# EAGLE design hothouse-no-branding (EAGLE 9.6.2)
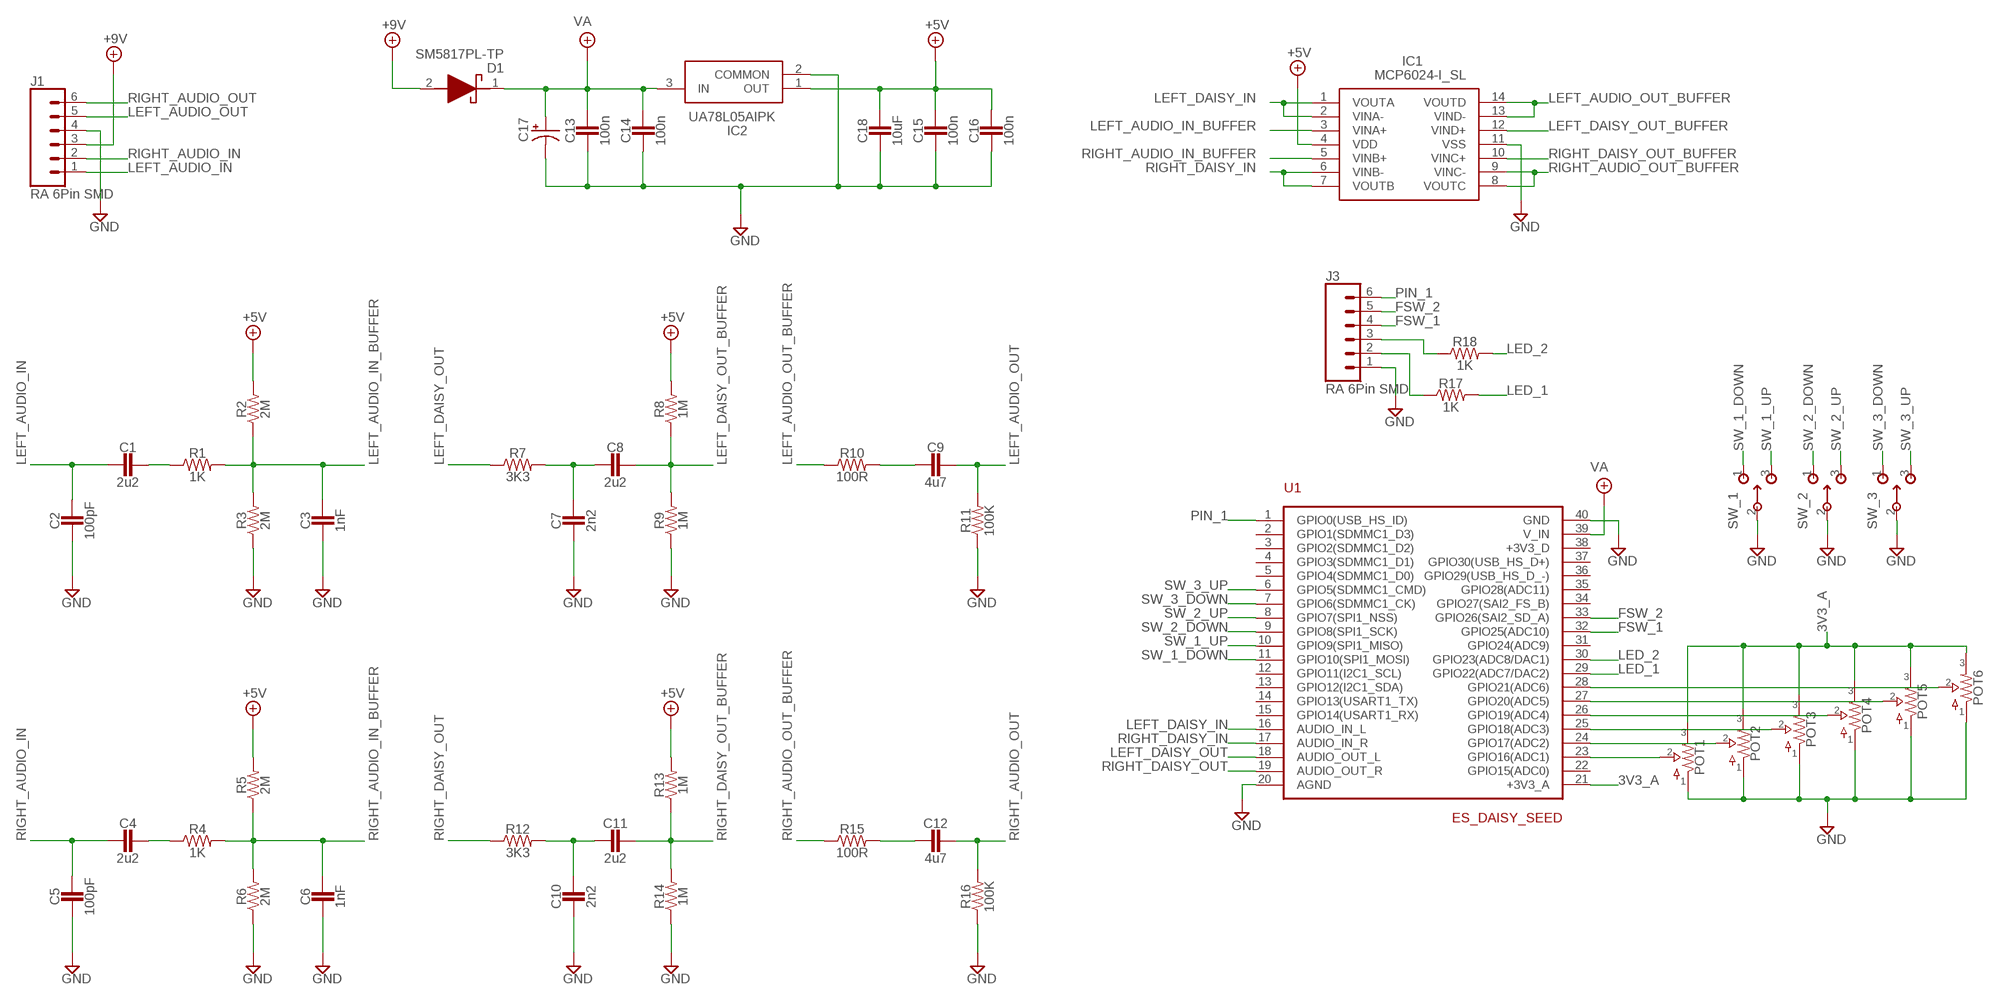
[diagram p0: schematic, sheet 1]

## Parts
C1  2u2  CAP1206  [RESISTOR_C1206]
C2  100pF  CAP0603  [RESISTOR_R0603]
C3  1nF  CAP0603  [RESISTOR_R0603]
C4  2u2  CAP1206  [RESISTOR_C1206]
C5  100pF  CAP0603  [RESISTOR_R0603]
C6  1nF  CAP0603  [RESISTOR_R0603]
C7  2n2  CAP0603  [RESISTOR_R0603]
C8  2u2  CAP1206  [RESISTOR_C1206]
C9  4u7  CAP1206  [RESISTOR_C1206]
C10  2n2  CAP0603  [RESISTOR_R0603]
C11  2u2  CAP1206  [RESISTOR_C1206]
C12  4u7  CAP1206  [RESISTOR_C1206]
C13  100n  CAP0805  [RESISTOR_C0805]
C14  100n  CAP0805  [RESISTOR_C0805]
C15  100n  CAP0805  [RESISTOR_C0805]
C16  100n  CAP0805  [RESISTOR_C0805]
C17  0631  [063_025]
C18  10uF  CAP0805  [RESISTOR_C0805]
D1  SM5817PL-TP  [SOD3716X120N]
IC1  MCP6024-I_SL  [SOIC127P600X175-14N]
IC2  UA78L05AIPK  [PK(R-PSSO-F3)]
J1  RA 6Pin SMD  CONN_06SILK_FEMALE_PTH  [1X06]
J3  RA 6Pin SMD  CONN_06SILK_FEMALE_PTH  [1X06]
POT1  16MM.1  [16MM_B.MOUNT]
POT2  16MM.1  [16MM_B.MOUNT]
POT3  16MM.1  [16MM_B.MOUNT]
POT4  16MM.1  [16MM_B.MOUNT]
POT5  16MM.1  [16MM_B.MOUNT]
POT6  16MM.1  [16MM_B.MOUNT]
R1  1K  RESISTOR0603  [RESISTOR_R0603]
R2  2M  RESISTOR0603  [RESISTOR_R0603]
R3  2M  RESISTOR0603  [RESISTOR_R0603]
R4  1K  RESISTOR0603  [RESISTOR_R0603]
R5  2M  RESISTOR0603  [RESISTOR_R0603]
R6  2M  RESISTOR0603  [RESISTOR_R0603]
R7  3K3  RESISTOR0603  [RESISTOR_R0603]
R8  1M  RESISTOR0603  [RESISTOR_R0603]
R9  1M  RESISTOR0603  [RESISTOR_R0603]
R10  100R  RESISTOR0603  [RESISTOR_R0603]
R11  100K  RESISTOR0603  [RESISTOR_R0603]
R12  3K3  RESISTOR0603  [RESISTOR_R0603]
R13  1M  RESISTOR0603  [RESISTOR_R0603]
R14  1M  RESISTOR0603  [RESISTOR_R0603]
R15  100R  RESISTOR0603  [RESISTOR_R0603]
R16  100K  RESISTOR0603  [RESISTOR_R0603]
R17  1K  RESISTOR0603  [RESISTOR_R0603]
R18  1K  RESISTOR0603  [RESISTOR_R0603]
SW_1  SPDT.LUGS  [SPDT.LUGS]
SW_2  SPDT.LUGS  [SPDT.LUGS]
SW_3  SPDT.LUGS  [SPDT.LUGS]
U1  ES_DAISY_SEED  [ES_DAISY_SEED]

## Nets
3V3_A: POT1.3 POT2.3 POT3.3 POT4.3 POT5.3 POT6.3 U1.21(+3V3_A)
+5V: C15.1 C16.1 C18.1 IC1.4(VDD) IC2.1(OUT) R2.2 R5.2 R8.2 R13.2
+9V: D1.2(A) J1.3
FSW_1: J3.4 U1.32(GPIO25(ADC10))
FSW_2: J3.5 U1.33(GPIO26(SAI2_SD_A))
GND: C2.2 C3.2 C5.2 C6.2 C7.2 C10.2 C13.2 C14.2 C15.2 C16.2 C17.- C18.2 IC1.11(VSS) IC2.2(COMMON) J1.4 J3.1 POT1.1 POT2.1 POT3.1 POT4.1 POT5.1 POT6.1 R3.1 R6.1 R9.1 R11.1 R14.1 R16.1 SW_1.2 SW_2.2 SW_3.2 U1.20(AGND) U1.40(GND)
LED_1: R17.2 U1.29(GPIO22(ADC7/DAC2))
LED_2: R18.2 U1.30(GPIO23(ADC8/DAC1))
LEFT_AUDIO_IN: C1.2 C2.1 J1.1
LEFT_AUDIO_IN_BUFFER: C3.1 IC1.3(VINA+) R1.2 R2.1 R3.2
LEFT_AUDIO_OUT: C9.1 J1.5 R11.2
LEFT_AUDIO_OUT_BUFFER: IC1.13(VIND-) IC1.14(VOUTD) R10.1
LEFT_DAISY_IN: IC1.1(VOUTA) IC1.2(VINA-) U1.16(AUDIO_IN_L)
LEFT_DAISY_OUT: R7.1 U1.18(AUDIO_OUT_L)
LEFT_DAISY_OUT_BUFFER: C8.1 IC1.12(VIND+) R8.1 R9.2
N$1: C4.1 R4.1
N$2: C1.1 R1.1
N$3: POT1.2 U1.23(GPIO16(ADC1))
N$4: C10.1 C11.2 R12.2
N$5: C12.2 R15.2
N$6: POT2.2 U1.24(GPIO17(ADC2))
N$7: C7.1 C8.2 R7.2
N$8: POT3.2 U1.25(GPIO18(ADC3))
N$9: POT4.2 U1.26(GPIO19(ADC4))
N$10: POT5.2 U1.27(GPIO20(ADC5))
N$11: POT6.2 U1.28(GPIO21(ADC6))
N$12: J3.3 R18.1
N$13: C9.2 R10.2
N$14: J3.2 R17.1
PIN_1: J3.6 U1.1(GPIO0(USB_HS_ID))
RIGHT_AUDIO_IN: C4.2 C5.1 J1.2
RIGHT_AUDIO_IN_BUFFER: C6.1 IC1.5(VINB+) R4.2 R5.1 R6.2
RIGHT_AUDIO_OUT: C12.1 J1.6 R16.2
RIGHT_AUDIO_OUT_BUFFER: IC1.8(VOUTC) IC1.9(VINC-) R15.1
RIGHT_DAISY_IN: IC1.6(VINB-) IC1.7(VOUTB) U1.17(AUDIO_IN_R)
RIGHT_DAISY_OUT: R12.1 U1.19(AUDIO_OUT_R)
RIGHT_DAISY_OUT_BUFFER: C11.1 IC1.10(VINC+) R13.1 R14.2
SW_1_DOWN: SW_1.1 U1.11(GPIO10(SPI1_MOSI))
SW_1_UP: SW_1.3 U1.10(GPIO9(SPI1_MISO))
SW_2_DOWN: SW_2.1 U1.9(GPIO8(SPI1_SCK))
SW_2_UP: SW_2.3 U1.8(GPIO7(SPI1_NSS))
SW_3_DOWN: SW_3.1 U1.7(GPIO6(SDMMC1_CK))
SW_3_UP: SW_3.3 U1.6(GPIO5(SDMMC1_CMD))
VA: C13.1 C14.1 C17.+ D1.1(K) IC2.3(IN) U1.39(V_IN)
Unconnected: U1.2(GPIO1(SDMMC1_D3)) U1.3(GPIO2(SDMMC1_D2)) U1.4(GPIO3(SDMMC1_D1)) U1.5(GPIO4(SDMMC1_D0)) U1.12(GPIO11(I2C1_SCL)) U1.13(GPIO12(I2C1_SDA)) U1.14(GPIO13(USART1_TX)) U1.15(GPIO14(USART1_RX)) U1.22(GPIO15(ADC0)) U1.31(GPIO24(ADC9)) U1.34(GPIO27(SAI2_FS_B)) U1.35(GPIO28(ADC11)) U1.36(GPIO29(USB_HS_D_-)) U1.37(GPIO30(USB_HS_D+)) U1.38(+3V3_D)

## Library data of the parts
C1-C16 C18 = hothouse-no-branding:CAP
C17 = hothouse-no-branding:063: 33 - 220uF Xicon values at Mouser.com 10V: 220uF; 16V: 100uF; 25V: 100uF; 50V: 33uF
D1 = hothouse-no-branding:SM5817PL-TP: Schottky Barrier Rectifiers Source: Datasheet <https://mccsemi.com/pdf/Products/SM5817PL-SM5819PL(SOD-123FL).pdf>; DESCRIPTION: Schottky Barrier Rectifiers; HEIGHT: 1.2mm; MANUFACTURER_NAME: MCC; MANUFACTURER_PART_NUMBER: SM5817PL-TP; MOUSER_PART_NUMBER: 833-SM5817PL-TP; MOUSER_PRICE-STOCK: https://www.mouser.co.uk/ProductDetail/Micro-Commercial-Components-MCC/SM5817PL-TP?qs=SdqRYZZ9IxAlhPsFLNd53A%3D%3D
IC1 = hothouse-no-branding:MCP6024-I_SL: Quad 2.3V 10MHz Op Amp,MCP6024-I/SL Source: Datasheet <https://datasheet.datasheetarchive.com/originals/distributors/SFDatasheet-4/sf-00090088.pdf>; DESCRIPTION: Quad 2.3V 10MHz Op Amp,MCP6024-I/SL; HEIGHT: 1.75mm; MANUFACTURER_NAME: Microchip; MANUFACTURER_PART_NUMBER: MCP6024-I/SL; MOUSER_PART_NUMBER: 579-MCP6024-I/SL; MOUSER_PRICE-STOCK: https://www.mouser.co.uk/ProductDetail/Microchip-Technology/MCP6024-I-SL?qs=QQ%252Byn%2FmNCzxlSLtX4H41uA%3D%3D
IC2 = hothouse-no-branding:UA78L05AIPK: 100-mA, 30-V VIN, Positive-Voltage Linear Regulators Source: Datasheet <http://www.ti.com/lit/ds/symlink/ua78l.pdf>; DESCRIPTION: 100-mA, 30-V VIN, Positive-Voltage Linear Regulators; HEIGHT: mm; MANUFACTURER_NAME: Texas Instruments; MANUFACTURER_PART_NUMBER: UA78L05AIPK; MOUSER_PART_NUMBER: 595-UA78L05AIPK; MOUSER_PRICE-STOCK: https://www.mouser.co.uk/ProductDetail/Texas-Instruments/UA78L05AIPK?qs=0O%2FZFlpUpJWsJcopcQmf%252BQ%3D%3D
J1 J3 = hothouse-no-branding:CONN_06: Multi connection point. Often used as Generic Header-pin footprint for 0.1 inch spaced/style header connections On any of the 0.1 inch spaced packages, you can populate with these: Break Away Headers - Straight <https://www.sparkfun.com/products/116> (PRT-00116) Break Away Male Headers - Right Angle <https://www.sparkfun.com/products/553> (PRT-00553) Female Headers <https://www.sparkfun.com/products/115> (PRT-00115) Break Away Headers - Machine Pin <https://www.sparkfun.com/products/117> (PRT-00117) Break Away Female Headers - Swiss Machine Pin <https://www.sparkfun.com/products/743> (PRT-00743) Arduino Stackable Header - 6 Pin <https://www.sparkfun.com/products/9280> (PRT-09280) For SCREWTERMINALS and SPRING TERMINALS visit here: Screw Terimnals on SparkFun.com <https://www.sparkfun.com/search/results?term=Screw+Terminals> (5mm/3.5mm/2.54mm spacing) This device is also useful as a general connection point to wire up your design to another part of your project. Our various solder wires solder well into these plated through hole pads. Hook-Up Wire - Assortment (Stranded, 22 AWG) <https://www.sparkfun.com/products/11375> (PRT-11375) Hook-Up Wire - Assortment (Solid Core, 22 AWG) <https://www.sparkfun.com/products/11367> (PRT-11367) View the entire wire category on our website here <https://www.sparkfun.com/categories/141>; PROD_ID: CONN-11293; SF_ID: GPS-00579
POT1-POT6 = hothouse-no-branding:16MM: 16mm Poteniometers
R1-R18 = hothouse-no-branding:RESISTOR
SW_1-SW_3 = hothouse-no-branding:SPDT: SPDT Switches
U1 = hothouse-no-branding:ES_DAISY_SEED; IPN: Daisy Seed

## Board
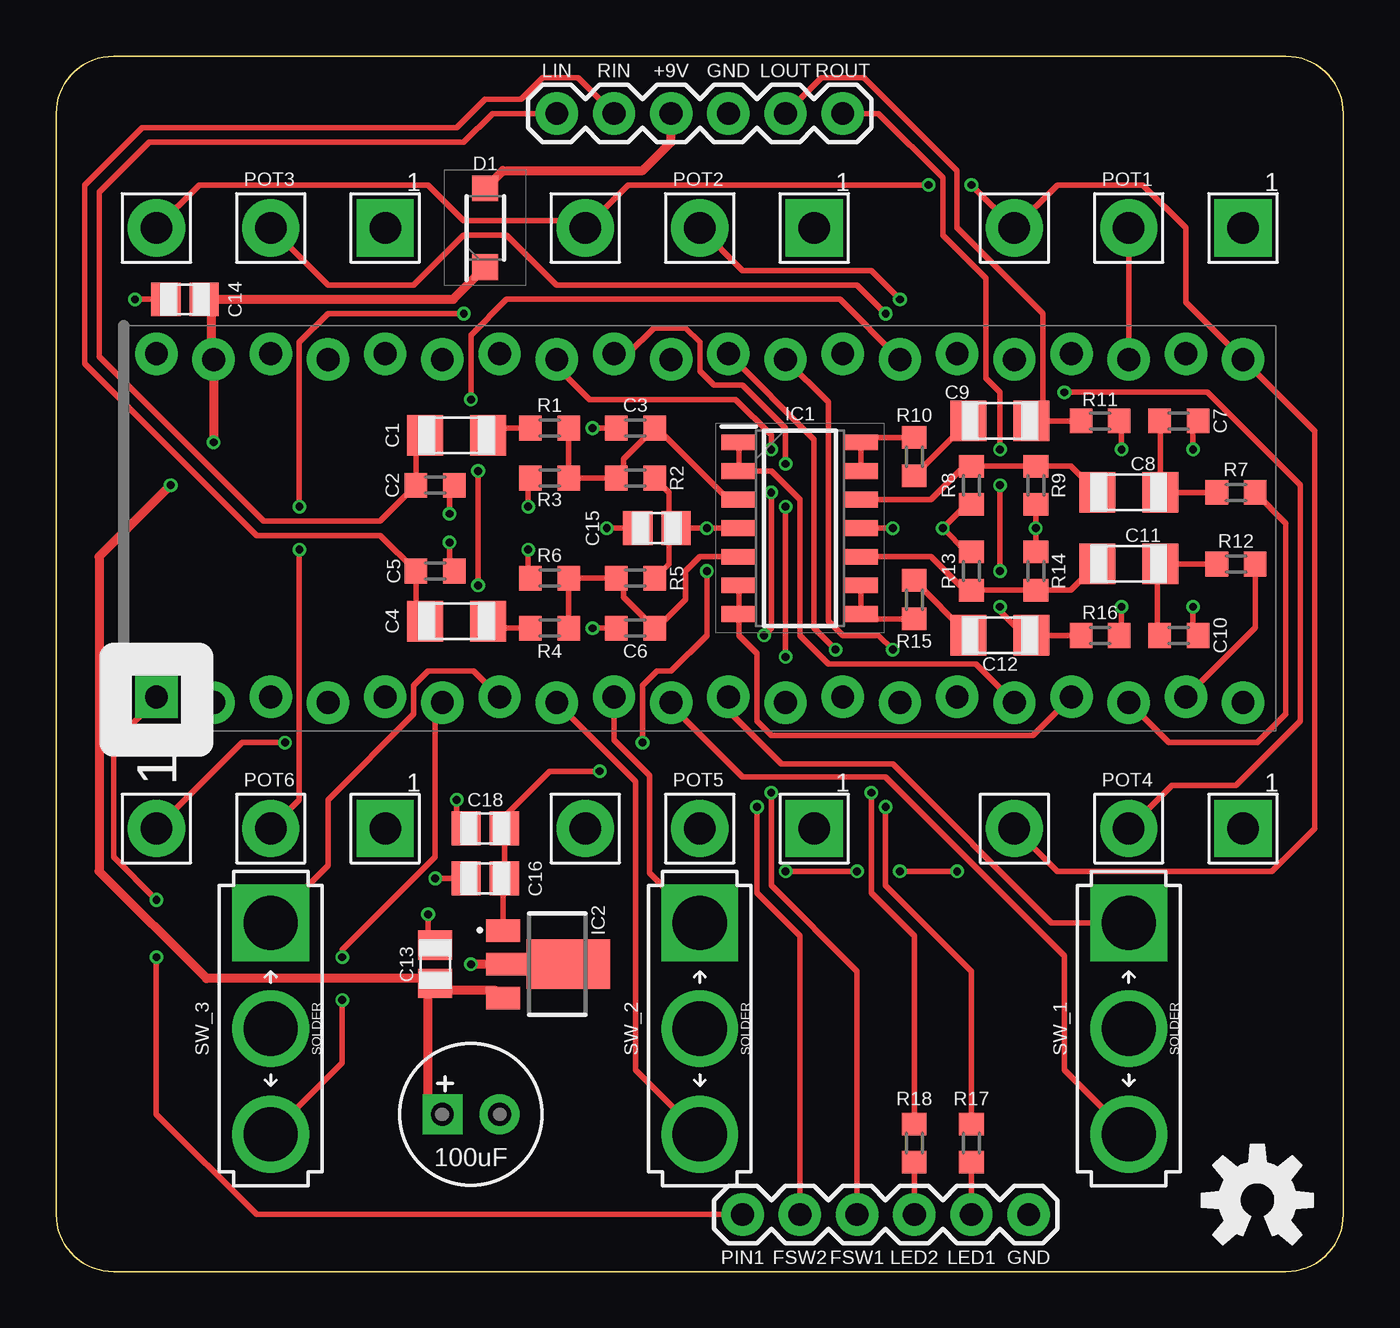
[diagram p1: board, top side]
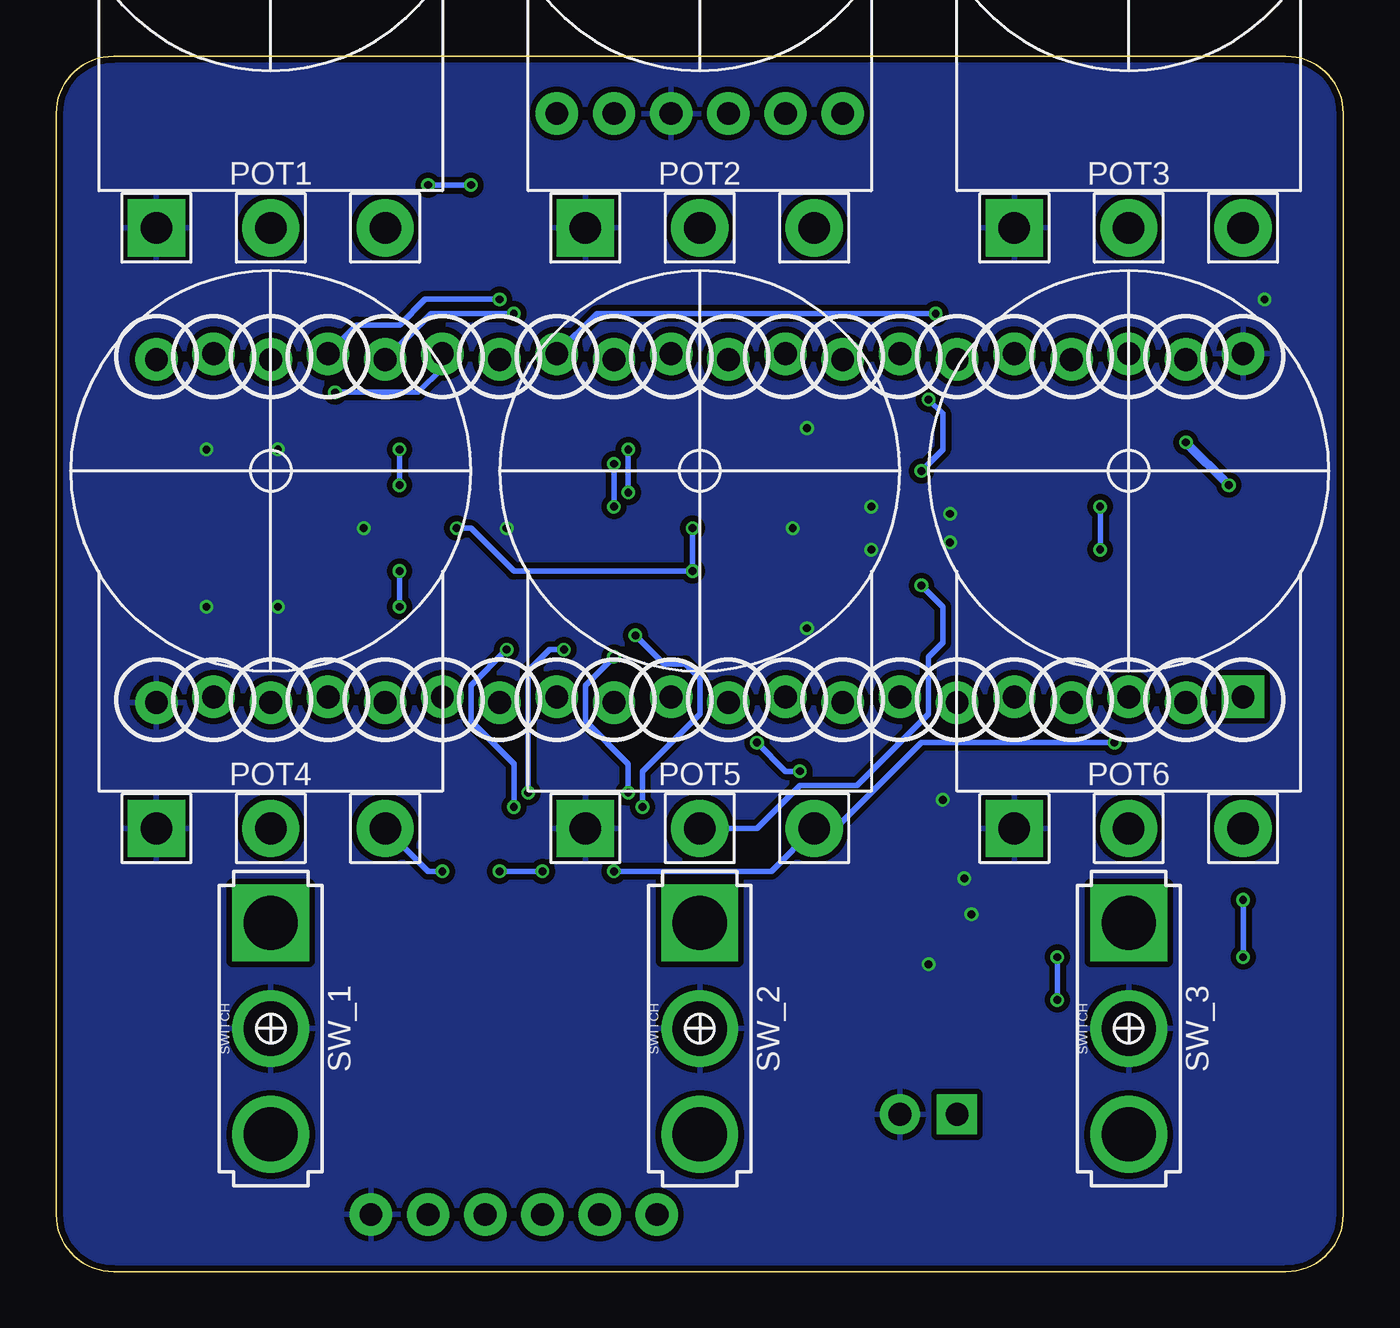
[diagram p2: board, bottom side, seen from below]

Size 57.15 x 53.98 mm. Coordinates in mm from the lower left corner, seen from the top.
Outline: 0,2.54 0,51.44 arc-90 2.54,53.98 54.61,53.98 arc-90 57.15,51.44 57.15,2.54 arc-90 54.61,0 2.54,0 arc-90 0,2.54
Copper layers (1*16): Top 0.035mm / dielectric 1.5mm / Bottom 0.035mm
Design rules "SparkFun-2-Layer-Minimum-JLCPCB": minimum track width 5mil, minimum drill 0.3mm, track to track 5mil, track to pad 5mil, pad to pad 5mil, via to via 5mil, smd to smd 5mil, copper to edge 7mil, drill to drill 7mil, minimum pad ring 5mil, minimum via ring 5mil, stop-mask expansion 2.5mil, vias tented up to drill 25mil, thermal gap 10mil

### Footprints (pad centres in the part's own frame; a part is rotated, then mirrored left to right if it is on the bottom)
RESISTOR_C1206 = smd 1.6 x 1.8: 1 -1.4,0; 2 1.4,0
RESISTOR_R0603 = smd 1 x 1.1: 1 -0.85,0; 2 0.85,0
RESISTOR_C0805 = smd 1.3 x 1.5: 1 -0.85,0; 2 0.85,0
063_025 = drill 1.016 pad 1.778 square: + -1.27,0 | drill 1.016 pad 1.778: - 1.27,0
SOD3716X120N = smd 1.15 x 1.15: 1 -1.75,0; 2 1.75,0
SOIC127P600X175-14N = smd 1.525 x 0.7: 1 -2.712,3.81; 2 -2.712,2.54; 3 -2.712,1.27; 4 -2.712,0; 5 -2.712,-1.27; 6 -2.712,-2.54; 7 -2.712,-3.81; 8 2.712,-3.81; 9 2.712,-2.54; 10 2.712,-1.27; 11 2.712,0; 12 2.712,1.27; 13 2.712,2.54; 14 2.712,3.81
PK(R-PSSO-F3) = smd 1 x 1.5: 1 -1.5,-3.65; 3 1.5,-3.65 | smd 1 x 1.8: 2 0,-3.5 | smd 2.2 x 3.7: 4 0,-0.75
1X06 = drill 1.016 pad 1.88: 1 0,0; 2 2.54,0; 3 5.08,0; 4 7.62,0; 5 10.16,0; 6 12.7,0
16MM_B.MOUNT = drill 1.4 pad 2.54 square: 1 5.08,0 | drill 1.4 pad 2.54: 2 0,0; 3 -5.08,0
SPDT.LUGS = drill 2.4 square: 1 0,4.699 | drill 2.4: 2 0,0; 3 0,-4.699
ES_DAISY_SEED = drill 1.016 pad 1.88 square: 1 -7.493,24.13 | drill 1.016 pad 1.88: 2 -7.747,21.59; 3 -7.493,19.05; 4 -7.747,16.51; 5 -7.493,13.97; 6 -7.747,11.43; 7 -7.493,8.89; 8 -7.747,6.35; 9 -7.493,3.81; 10 -7.747,1.27; 11 -7.493,-1.27; 12 -7.747,-3.81; 13 -7.493,-6.35; 14 -7.747,-8.89; 15 -7.493,-11.43; 16 -7.747,-13.97; 17 -7.493,-16.51; 18 -7.747,-19.05; 19 -7.493,-21.59; 20 -7.747,-24.13; 21 7.493,-24.13; 22 7.747,-21.59; 23 7.493,-19.05; 24 7.747,-16.51; 25 7.493,-13.97; 26 7.747,-11.43; 27 7.493,-8.89; 28 7.747,-6.35; 29 7.493,-3.81; 30 7.747,-1.27; 31 7.493,1.27; 32 7.747,3.81; 33 7.493,6.35; 34 7.747,8.89; 35 7.493,11.43; 36 7.747,13.97; 37 7.493,16.51; 38 7.747,19.05; 39 7.493,21.59; 40 7.747,24.13

### Placement (x,y rotation side)
C1  17.78,37.15 180 top
C2  16.83,34.92 0 top
C3  25.72,37.47 180 top
C4  17.78,28.89 180 top
C5  16.83,31.11 0 top
C6  25.72,28.57 180 top
C7  49.85,37.78 0 top
C8  47.62,34.61 0 top
C9  41.91,37.78 180 top
C10  49.85,28.26 0 top
C11  47.62,31.43 0 top
C12  41.91,28.26 180 top
C13  16.83,13.65 90 top
C14  5.71,43.18 180 top
C15  26.67,33.02 180 top
C16  19.05,17.46 180 top
C17  18.41,6.99 0 top
C18  19.05,19.68 180 top
D1  19.05,46.35 90 top
IC1  33.02,33.02 0 top
IC2  23.5,13.65 270 top
J1  22.23,51.44 0 top
J3  43.18,2.54 180 top
POT1  47.62,46.35 0 top
POT2  28.57,46.35 0 top
POT3  9.53,46.35 0 top
POT4  47.62,19.68 0 top
POT5  28.57,19.68 0 top
POT6  9.53,19.68 0 top
R1  21.91,37.47 0 top
R2  25.72,35.24 0 top
R3  21.91,35.24 0 top
R4  21.91,28.57 0 top
R5  25.72,30.8 0 top
R6  21.91,30.8 0 top
R7  52.39,34.61 180 top
R8  40.64,34.92 270 top
R9  43.5,34.92 90 top
R10  38.1,36.2 270 top
R11  46.35,37.78 180 top
R12  52.39,31.43 180 top
R13  40.64,31.11 90 top
R14  43.5,31.11 270 top
R15  38.1,29.84 90 top
R16  46.35,28.26 180 top
R17  40.64,5.71 90 top
R18  38.1,5.71 90 top
SW_1  47.62,10.79 0 top
SW_2  28.57,10.79 0 top
SW_3  9.53,10.79 0 top
U1  28.57,33.02 90 top
U$1  [OSHW-LOGO-M]  53.34,3.17 0 top
U$2  [125B_MULTI_DRILL]  28.57,15.24 0 top

### Tracks (layer width: path | path; a pad name or v marks a point on that pad's centre or on a via)
3V3_A  (via drill 0.35)
  Top 0.254: POT3.3 6.35,48.26 16.51,48.26 18.1,46.67 23.18,46.67 POT2.3 25.4,48.26 v38.73,48.26 | v40.64,48.26 POT1.3 44.45,48.26 48.26,48.26 50.16,46.35 50.16,43.05 U1.21 55.88,37.34 55.88,19.68 53.98,17.78 44.45,17.78 POT4.3 | v10.16,23.5 8.26,23.5 POT6.3 | v32.38,17.78 v35.56,17.78 | v37.47,17.78 v40.01,17.78
  Bottom 0.254: v40.64,48.26 v38.73,48.26 | v10.16,23.5 18.73,23.5 22.54,19.68 POT5.3 25.4,17.78 v32.38,17.78 | POT4.3 40.64,17.78 v40.01,17.78 | v35.56,17.78 v37.47,17.78
+5V  (via drill 0.35)
  Top 0.254: C15.1 27.2,33.34 27.2,34.61 R2.2 | R5.2 27.2,31.43 27.2,32.7 C15.1 | C15.1 v28.89,33.02 IC1.4 | v26.04,23.5 26.04,26.04 26.67,26.67 27.3,26.67 28.89,28.26 v28.89,31.11 | v24.13,22.23 21.91,22.23 19.9,20.22 C18.1 C16.1 19.9,16.8 19.84,16.74 IC2.1 | R8.2 40.42,34.08 v39.37,33.02 40.42,31.96 R13.2
  Bottom 0.254: v28.89,33.02 v28.89,31.11 36.83,31.11 38.73,33.02 v39.37,33.02 | v26.04,23.5 24.77,22.23 v24.13,22.23
+9V
  Top 0.406: D1.2 19.84,48.9 26.04,48.9 27.3,50.16 J1.3
FSW_1  (via drill 0.35)
  Top 0.254: v32.38,35.88 32.38,37.47 30.48,39.37 29.21,39.37 28.57,40.01 28.57,41.27 27.94,41.91 26.54,41.91 25.4,40.77 U1.32 | v32.38,33.97 v32.38,27.3 | v31.75,21.27 31.75,17.14 35.56,13.34 J3.4
  Bottom 0.254: v32.38,35.88 v32.38,33.97 | v32.38,27.3 33.66,26.04 33.66,24.45 31.75,22.54 v31.75,21.27
FSW_2  (via drill 0.35)
  Top 0.254: v31.75,34.61 31.75,28.57 v31.43,28.26 | v31.75,36.51 31.75,37.15 30.16,38.73 23.69,38.73 22.23,40.2 U1.33 | v31.11,20.64 31.11,16.83 33.02,14.92 J3.5
  Bottom 0.254: v31.75,36.51 v31.75,34.61 | v31.11,20.64 31.11,22.23 28.57,24.77 28.57,26.35 29.21,26.99 30.16,26.99 v31.43,28.26
GND  (via drill 0.35)
  Top 0.254: C2.2 17.46,34.71 v17.46,33.66 | v17.46,32.38 17.46,31.33 C5.2 | R3.1 20.95,35.14 v20.95,33.97 | R6.1 20.95,30.9 v20.95,32.07 | C14.2 v3.49,43.18 | R11.1 47.31,37.68 v47.31,36.51 | C7.2 50.48,37.57 v50.48,36.51 | C10.2 50.48,28.47 v50.48,29.53 | C15.2 v24.45,33.02 | C6.2 v23.81,28.57 | IC1.11 v37.15,33.02 | C3.2 v23.81,37.47 | R16.1 47.31,28.36 v47.31,29.53 | C16.2 v16.83,17.46 | R9.1 v43.5,33.02 R14.1 | C13.2 16.51,14.82 v16.51,15.88 | C18.2 17.78,20.11 v17.78,20.95
  Top 0.406: IC2.2 v18.41,13.65
  pour Bottom (isolate 0.254): 0,26.67 0,51.44 arc-90 2.54,53.98 23.5,53.98 54.61,53.98 arc-90 57.15,51.44 57.15,13.97 57.15,2.54 arc-90 54.61,0 24.13,0 2.54,0 arc-90 0,2.54
LED_1  (via drill 0.35)
  Top 0.254: U1.29 34.29,38.61 34.29,28.89 34.92,28.26 36.51,28.26 v37.15,27.62 | v36.83,20.64 36.83,17.14 40.64,13.34 R17.2
  Bottom 0.254: v37.15,27.62 38.73,26.04 38.73,24.45 36.83,22.54 v36.83,20.64
LED_2  (via drill 0.35)
  Top 0.254: v36.2,21.27 36.2,16.83 38.1,14.92 R18.2 | U1.30 33.66,36.96 33.66,28.57 v34.61,27.62
  Bottom 0.254: v36.2,21.27 36.2,26.67 35.24,27.62 v34.61,27.62
LEFT_AUDIO_IN
  Top 0.254: J1.1 19.37,51.44 18.1,50.16 4.13,50.16 1.91,47.94 1.91,40.64 9.21,33.34 14.39,33.34 C2.1 15.98,36.74 C1.2
LEFT_AUDIO_IN_BUFFER
  Top 0.254: R1.2 R3.2 R2.1 25.18,35.56 25.18,36.08 C3.1 26.67,37.47 29.84,34.29 IC1.3
LEFT_AUDIO_OUT
  Top 0.254: R11.2 C9.1 43.81,38.29 43.81,42.55 40.01,46.35 40.01,48.9 35.88,53.02 33.97,53.02 J1.5
LEFT_AUDIO_OUT_BUFFER
  Top 0.254: IC1.13 IC1.14 35.95,37.05 R10.1
LEFT_DAISY_IN
  Top 0.254: U1.16 40.83,26.99 34.29,26.99 33.02,28.26 33.02,34.29 31.75,35.56 IC1.2 IC1.1
LEFT_DAISY_OUT
  Top 0.254: U1.18 49.4,23.5 53.34,23.5 54.61,24.77 54.61,33.23 R7.1
LEFT_DAISY_OUT_BUFFER
  Top 0.254: C8.1 45.06,35.77 R9.2 R8.1 40.32,35.77 38.84,34.29 IC1.12
N$1
  Top 0.254: R4.1 19.5,28.57 C4.1
N$2
  Top 0.254: R1.1 19.5,37.47 C1.1
N$3
  Top 0.254: POT1.2 U1.23
N$4
  Top 0.254: C10.1 48.9,28.16 48.9,31.3 C11.2 R12.2
N$5
  Top 0.254: R15.2 40.51,28.29 C12.2
N$6  (via drill 0.35)
  Top 0.254: POT2.2 30.48,44.45 36.2,44.45 v37.47,43.18
  Bottom 0.254: U1.24 43.81,42.04 41.91,42.04 40.77,43.18 v37.47,43.18
N$7
  Top 0.254: C7.1 49.02,37.76 C8.2 50.8,34.61 | 50.8,34.61 R7.2 | 50.8,34.61
N$8  (via drill 0.35)
  Top 0.254: POT3.2 12.06,43.81 15.88,43.81 18.1,46.04 20,46.04 22.23,43.81 35.56,43.81 v36.83,42.55
  Bottom 0.254: U1.25 40.51,42.55 v36.83,42.55
N$9  (via drill 0.35)
  Top 0.254: v44.77,39.05 51.12,39.05 55.24,34.92 55.24,24.45 52.39,21.59 49.53,21.59 POT4.2
  Bottom 0.254: v44.77,39.05 41.08,39.05 40.01,40.13 U1.26
N$10  (via drill 0.35)
  Top 0.254: v18.41,38.73 18.41,41.59 20,43.18 34.8,43.18 U1.27 | v18.73,35.56 v18.73,30.48
  Bottom 0.254: POT5.2 26.04,19.68 24.13,21.59 21.59,21.59 18.41,24.77 18.41,27.3 17.78,27.94 17.78,29.53 v18.73,30.48 | v18.41,38.73 17.78,38.1 17.78,36.51 v18.73,35.56
N$11  (via drill 0.35)
  Top 0.254: POT6.2 10.79,20.95 v10.79,32.07 | v10.79,33.97 10.79,41.27 12.06,42.55 v18.1,42.55
  Bottom 0.254: U1.28 33.15,42.55 v18.1,42.55 | v10.79,33.97 v10.79,32.07
N$12
  Top 0.254: J3.3 R18.1
N$13
  Top 0.254: R10.2 40.51,37.76 C9.2
N$14
  Top 0.254: J3.2 R17.1
PIN_1  (via drill 0.35)
  Top 0.254: J3.6 8.89,2.54 4.45,6.99 v4.45,13.97 | U1.1 4.45,25.4 2.54,23.5 2.54,18.41 v4.45,16.51
  Bottom 0.254: v4.45,16.51 v4.45,13.97
RIGHT_AUDIO_IN
  Top 0.254: C4.2 15.98,29.3 C5.1 14.39,32.7 8.89,32.7 1.27,40.32 1.27,48.26 3.81,50.8 17.78,50.8 19.05,52.07 20.64,52.07 21.59,53.02 23.18,53.02 J1.2
RIGHT_AUDIO_IN_BUFFER
  Top 0.254: R4.2 R6.2 R5.1 25.18,30.48 25.18,29.96 C6.1 26.67,28.57 27.94,29.84 27.94,31.11 28.57,31.75 IC1.5
RIGHT_AUDIO_OUT  (via drill 0.35)
  Top 0.254: R16.2 C12.1 42.99,28.26 41.91,29.34 v41.91,29.53 | J1.6 36.51,51.44 39.37,48.58 39.37,46.04 41.27,44.13 41.27,39.69 41.91,39.05 v41.91,36.51 | v41.91,34.92 v41.91,31.11
  Bottom 0.254: v41.91,36.51 v41.91,34.92 | v41.91,31.11 v41.91,29.53
RIGHT_AUDIO_OUT_BUFFER
  Top 0.254: R15.1 35.95,29 IC1.8 IC1.9
RIGHT_DAISY_IN
  Top 0.254: U1.17 43.37,23.81 31.75,23.81 31.11,24.45 31.11,27.45 30.31,28.26 IC1.7 IC1.6
RIGHT_DAISY_OUT
  Top 0.254: U1.19 53.24,28.6 R12.1
RIGHT_DAISY_OUT_BUFFER
  Top 0.254: C11.1 45.06,30.27 R14.2 R13.1 40.32,30.27 38.84,31.75 IC1.10
SW_1_DOWN
  Top 0.254: U1.11 29.84,24.89 32.19,22.54 37.15,22.54 44.2,15.49 SW_1.1
SW_1_UP
  Top 0.254: U1.10 27.3,25.15 30.48,21.97 36.83,21.97 44.77,14.03 44.77,8.95 SW_1.3
SW_2_DOWN
  Top 0.254: U1.9 24.77,23.62 26.35,22.04 26.35,17.72 SW_2.1
SW_2_UP
  Top 0.254: U1.8 25.72,21.78 25.72,8.95 SW_2.3
SW_3_DOWN
  Top 0.254: SW_3.1 12.06,18.03 12.06,20.95 15.88,24.77 15.88,26.04 16.51,26.67 18.54,26.67 U1.7
SW_3_UP  (via drill 0.35)
  Top 0.254: SW_3.3 12.7,9.27 v12.7,12.06 | v12.7,13.97 12.7,14.29 16.83,18.41 16.83,24.96 U1.6
  Bottom 0.254: v12.7,13.97 v12.7,12.06
VA  (via drill 0.35)
  Top 0.406: D1.1 17.62,43.18 C14.1 6.88,42.86 6.88,40.62 U1.39 v6.99,36.83 | IC2.3 19.51,12.48 17.14,12.48 C13.1 | v5.08,34.92 1.91,31.75 1.91,17.78 6.67,13.02 16.61,13.02 C13.1 | C13.1 16.51,12.48 16.51,7.68 17.14,7.04 C17.+
  Bottom 0.406: v6.99,36.83 v5.08,34.92

### Text on the board
tPlace: LIN | RIN | +9V | GND | LOUT | ROUT | 100uF | PIN1 | FSW2 | FSW1 | LED2 | LED1 | GND